# Altium schematic sheet Oscillator.SchDoc: Oscillator
size A4; Engineer: CT; SheetNumber: 4; SheetTotal: 4
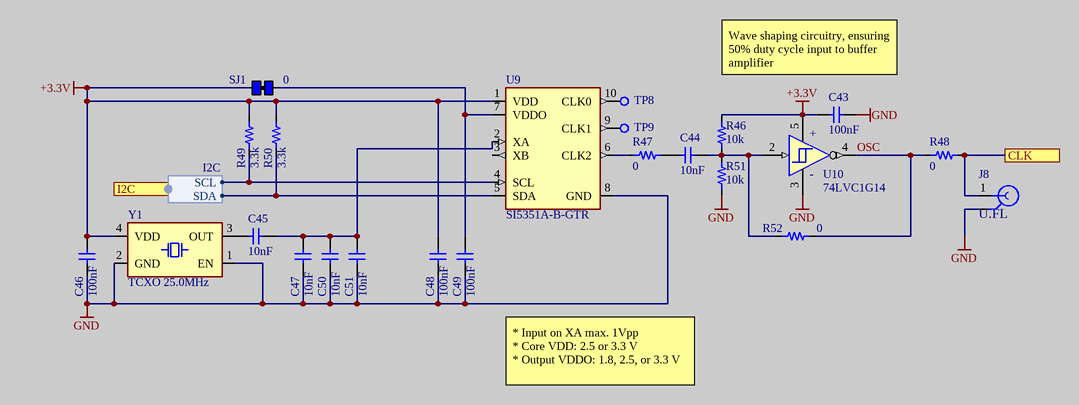
[diagram p0: Oscillator.SchDoc]

## Parts
C43  value 100nF  [0603-C-N]  (hidden comment: Capacitor 100nF +/-10% 50V X7R 0603)
C44  value 10nF  [0603-C-N]  (hidden comment: Capacitor 10nF 50V NP0 0603)
C45  value 10nF  [0603-C-N]  (hidden comment: Capacitor 10nF 50V NP0 0603)
C46  value 100nF  [0603-C-N]  (hidden comment: Capacitor 100nF +/-10% 50V X7R 0603)
C47  value 10nF  [0603-C-N]  (hidden comment: Capacitor 10nF 50V NP0 0603)
C48  value 100nF  [0603-C-N]  (hidden comment: Capacitor 100nF +/-10% 50V X7R 0603)
C49  value 100nF  [0603-C-N]  (hidden comment: Capacitor 100nF +/-10% 50V X7R 0603)
C50  value 10nF  [0603-C-N]  (hidden comment: Capacitor 10nF 50V NP0 0603)
C51  value 10nF  [0603-C-N]  (hidden comment: Capacitor 10nF 50V NP0 0603)
J8  U.FL-R-SMT(10)  [HRS-U.FL-R-SMT_V]  (value not drawn)
R46  value 10k  [0603-R-N]  (hidden comment: Resistor 10k +/-1% 50V 0603)
R47  value 0  [0603-R-N]  (hidden comment: Jumper 0R <50 mOhm 1A 0603)
R48  value 0  [0603-R-N]  (hidden comment: Jumper 0R <50 mOhm 1A 0603)
R49  value 3.3k  [0603-R-N]  (hidden comment: Resistor 3.3k +/-1% 50V 0603)
R50  value 3.3k  [0603-R-N]  (hidden comment: Resistor 3.3k +/-1% 50V 0603)
R51  value 10k  [0603-R-N]  (hidden comment: Resistor 10k +/-1% 50V 0603)
R52  value 0  [0603-R-N]  (hidden comment: Jumper 0R <50 mOhm 1A 0603)
SJ1  value 0  [SJ_0603_1A]  (hidden comment: SJ-0603-1A)  (net tie, no BOM)
TP8  Testpad with multiple sizes  [TP_1.5mm]  (value not drawn)  (no BOM)
TP9  Testpad with multiple sizes  [TP_1.5mm]  (value not drawn)  (no BOM)
U9  SI5351A-B-GTR  [VSSOP10-N]
U10  value 74LVC1G14  [SOT25-N]  (hidden comment: SN74LVC1G14DBVR)
Y1  value TCXO 25.0MHz  [WE-SPXO_IQXO-791]  (hidden comment: SX2T25.000B010J020S)

## Ports
CLK, I2C (harness I2C)

## Harnesses
I2C: SDA, SCL

## Nets
+3.3V: C43.2 C46.1 C48.1 R46.1 R49.2 R50.2 SJ1.1(L) U9.1(VDD) U10.5(VCC) Y1.4(VDD)
GND: C43.1 C46.2 C47.1 C48.2 C49.2 C50.1 C51.1 J8.2(GND) R51.2 U9.8(GND) U10.3(GND) Y1.1(EN) Y1.2(GND)
CLK: J8.1(SIG) R48.1 ; port CLK
OSC: R48.2 R52.2 U10.4(Y)
NetC44_1: C44.1 R47.1
NetC44_2: C44.2 R46.2 R51.1 R52.1 U10.2(A)
NetC45_1: C45.1 Y1.3(OUT)
NetC45_2: C45.2 C47.2 C50.2 C51.2 U9.2(XA)
NetC49_1: C49.1 SJ1.2(R) U9.7(VDDO)
NetR47_2: R47.2 U9.6(CLK2)
NetR49_1: R49.1 U9.4(SCL) ; port I2C.SCL
NetR50_1: R50.1 U9.5(SDA) ; port I2C.SDA
NetTP8_1: TP8.1(Pad) U9.10(CLK0)
NetTP9_1: TP9.1(Pad) U9.9(CLK1)

Not connected (* = marked no-connect by the designer): U9 3(XB)

## Notes on the sheet
- Wave shaping circuitry, ensuring 50% duty cycle input to buffer amplifier
- * Input on XA max. 1Vpp
  * Core VDD: 2.5 or 3.3 V
  * Output VDDO: 1.8, 2.5, or 3.3 V
- Title
- Sheet Revision:
- Link:
- Size:
- Project:
- Engineer:
- A4
- Date:
- Sheet
- of
- File:
- (in symbol CMP-016-00025-4) +; -

## Library data of the parts
C43 C46 C48 C49 = CMP-072-000619-14: WCAP-CSGP Multilayer Ceramic Chip Capacitor, General Purpose, size 0603, X7R, 100nF, 50VDC; Dissipation Factor: 3%; Tolerance: 10%; Capacitor Type: MLCC; Insulation Resistance: 5GO; Technical Reference: X7R0603104K050DFCT10000; ComponentLink2Description: Datasheet Link; Dielectric: X7R; ComponentLink2URL: https://www.we-online.com/redexpert/spec/885012206095?ad; Case/Package: 0603; Voltage Rating: 50V; Height: 0.8mm; JLCPCB Part #: C14663; Design Item ID: 885012206095; Pins: 2; Min Operating Temperature: -55°C; Max Operating Temperature: 125°C; Width: 0.8mm; ComponentLink1URL: https://www.we-online.com/redexpert/article/885012206095?ad; Match Code: WCAP-CSGP; Packaging: Tape and Reel; Source: WCAP-CSGP.SchLib; Usage: General Purpose; Length: 1.6mm; ComponentLink1Description: Website Link; Mounting Technology: SMT
C44 C45 C47 C50 C51 = CMP-001-00137-5: Multilayer Ceramic Capacitor, Grm Series, 0.01 F, 5%, C0g / Np0, 50 V, 0603 [1608 Metric]; FLIR Part #: YCAM10N-7; Temperature Coefficient: 30ppm/°C; Reach SVHC Compliant: No; Case/Package: 0603; Thickness: 0.035inch; Width: 0.8mm; Case Code (Metric): 1608; Termination: SMD/SMT; Min Operating Temperature: -55°C; Voltage Rating (DC): 50V; Mounting Technology: Surface Mount; Package Quantity: 4000; Depth: 0.8mm; Dielectric: C0G; Packaging: Cut Tape; Voltage: 50V; Max Operating Temperature: 125°C; RoHS Compliant: Yes; Material: Ceramic; Lead Pitch: 0.5mm; Case Code (Imperial): 0603; Tolerance: 5%; Voltage Rating: 50V; Lead Free: Lead Free; Height: 0.8mm; Length: 1.6mm; JLCPCB Part #: C85973; Series: GRM
J8 = CMP-002-00035-11: Ultra Small Surface Mount Coaxial Connector, 50 Ohm, -40 to 90 degC, 3-Pin SMD, RoHS, Tape and Reel; pin to pad: 1>3 2>1+2; Manufacturer: Hirose Electric; Resistance: 50Ohm; Connector Type: RF&Coax; Value: U.FL; Package Reference: U.FL-R-SMT; Datasheet Version: Aug-16; Package Description: 3-Pin Surface Mount Device, Body 2.6 x 2.6 mm; Fastening Type: Snap; Datasheet URL: https://www.hirose.com/product/en/download_file/key_name/U.FL/category/Catalog/doc_file_id/31697/?file_category_id=4&item_id=15&is_series=1; Manufacturer URL: https://www.hirose.com; Contact Plating: Gold; Max Operating Temperature: 90°C; Package Quantity: 2500; Impedance: 50Ohm; JLCPCB Part #: C88373; Packaging: TapeandReel; Min Operating Temperature: -40°C; Mounting Technology: SM; RoHS Compliant: True; Contact Material: Brass; Case/Package: U.FL-R-SMT
R46 R51 = CMP-009-00017-27: Chip Resistor, Thick Film, General Purpose, 0603, 100mW, 50V, 10 kOhm, +/-1%; FLIR Part #: YRES10K-1; Tolerance: 1%; Elements: 1; RoHS Compliant: Yes; Mounting Technology: SMT; Pins: 2; Case/Package: 0603; Usage: General Purpose; JLCPCB Part #: C25804; Max Operating Temperature: 155°C; Min Operating Temperature: -55°C; Power Rating: 100mW; Resistor Type: Thick Film; Voltage Rating: 50V
R47 R48 R52 = CMP-009-00006-25: Chip Jumper, Thick Film, Jumper, 0603, 100mW, 1A, 0 Ohm, <50 mOhm; FLIR Part #: YRES0E-1; Tolerance: 50 mOhm; Voltage Rating: 75V; Elements: 1; Usage: Jumper; Case/Package: 0603; Power Rating: 100mW; Current Rating: 1A; Min Operating Temperature: -55°C; RoHS Compliant: True; Resistor Type: Thick Film; Max Operating Temperature: 155°C; JLCPCB Part #: C21189; Pins: 2; Mounting Technology: SMT
R49 R50 = CMP-009-00243-17: Chip Resistor, Thick Film, General Purpose, 0603, 100mW, 50V, 3.3 kOhm, +/-1%; Tolerance: 1%; Elements: 1; Usage: General Purpose; Min Operating Temperature: -55°C; Voltage Rating: 50V; JLCPCB Part #: C22978; Max Operating Temperature: 155°C; Power Rating: 100mW; Resistor Type: Thick Film; RoHS Compliant: Yes; Case/Package: 0603; Mounting Technology: SMT; Pins: 2
SJ1 = CMP-009-00345-4: Solder Jumper, Thick Film, Jumper, 0603, 100mW, 1A, 0 Ohm, <50 mOhm; Voltage Rating: 50V; Elements: 1; Temperature Coefficient: 200ppm/°C; Tolerance: 50 mOhm; Power Rating: 100mW; Pins: 2; JLCPCB Part #: C876125; RoHS Compliant: Yes; Resistor Type: Thick Film; Max Operating Temperature: 155°C; Lead Free: Lead Free; Usage: Jumper; Mounting Technology: SMT; Min Operating Temperature: -55°C; Case/Package: 0603
TP8 TP9 = CMP-027-000000-15: Testpad land; Source: 7c7_Connectors.SchLib; Component Type: Standard; Design Item ID: Testpad; Pin Count: 1
U9 = CMP-023-00007-2: IC CLK GENERATOR 160MHZ 10MSOP; Number of Outputs: 3; Operating Supply Voltage: 3.3V; Number of Circuits: 2; PLL: Yes; Clock Frequency: 200MHz; Input: Crystal; Operating Supply Current: 22mA; Max Duty Cycle: 55%; Min Operating Temperature: -40°C; RoHS Compliant: Yes; Pins: 10; Package Quantity: 2500; Series: MultiSynth™; Max Operating Temperature: 85°C; Packaging: Tape and Reel; JLCPCB Part #: C504891; Mounting Technology: Surface Mount; Case/Package: MSOP
U10 = CMP-016-00025-4: Single 1.65-V to 5.5-V inverter with Schmitt-Trigger inputs 5-SOT-23 -40 to 125; High Level Output Current: -32mA; Max Supply Voltage: 5.5V; Number of Circuits: 1; Output Current: 32mA; Quiescent Current: 10uA; Min Supply Voltage: 1.65V; Input Type: SCHMITT TRIGGER; Turn-On Delay Time: 11ns; Logic Function: Buffer,Inverter,Schmitt Trigger; Propagation Delay: 5ns; Termination: SMD/SMT; Weight: 0.000557oz; Max Operating Temperature: 125°C; RoHS Compliant: Yes; Radiation Hardening: No; Min Operating Temperature: -40°C; JLCPCB Part #: C7835; Mounting Technology: Surface Mount; Package Quantity: 1; Series: 74LVC; Number of Gates: 1; Number of Elements: 1; Number of Bits: 1; Reach SVHC Compliant: No; Packaging: Tape and Reel; Pins: 5; Lead Free: Lead Free; Number of Inputs: 1; Low Level Output Current: 32mA; Max Output current: 32mA; Case/Package: SOT-23; Technology: CMOS
Y1 = CMP-002-001569-1: TCXO 25MHz, 3.3V; Frequency Tolerance: 1ppm; JLCPCB Part #: C5180005